# Altium schematic sheet blackfin_b_flash.SchDoc
size A3
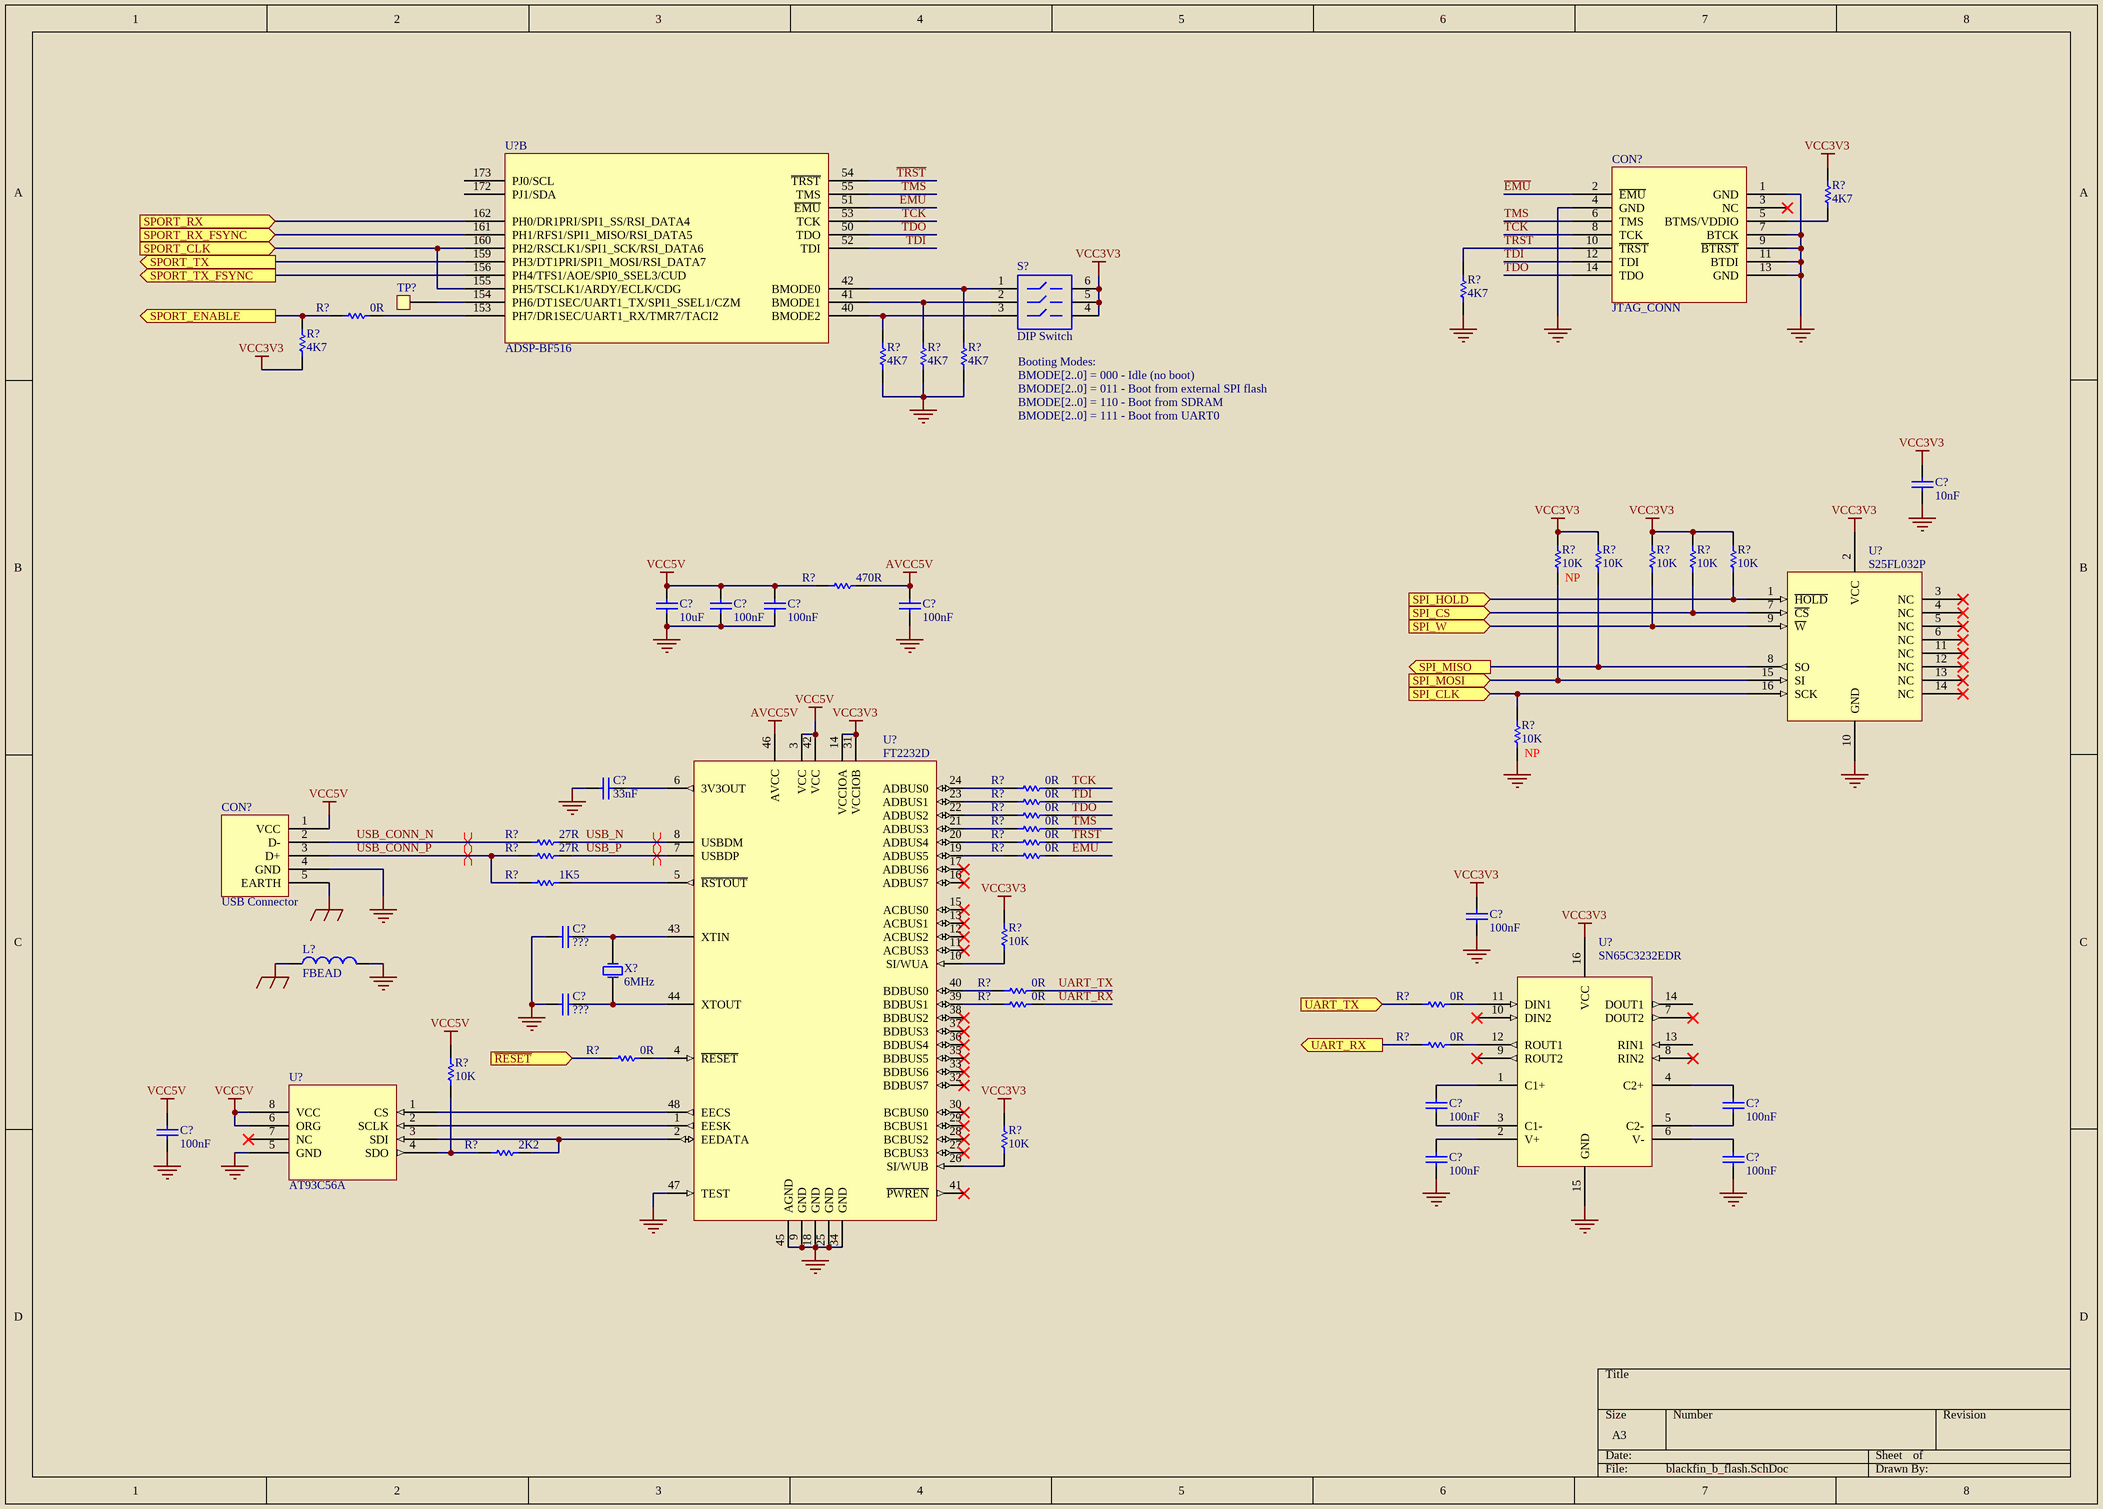
[diagram p0: blackfin_b_flash.SchDoc]

## Parts
(Parts that share a designator on the sheet are numbered #1, #2 ... from top to bottom, then left to right.)
C?#1  10nF  [C_0603]
C?#2  10uF  [C_0805]
C?#3  100nF  [C_0603]
C?#4  100nF  [C_0603]
C?#5  100nF  [C_0603]
C?#6  33nF  [C_0603]
C?#7  ???  [C_0603]
C?#8  100nF  [C_0603]
C?#9  ???  [C_0603]
C?#10  100nF  [C_0603]
C?#11  100nF  [C_0603]
C?#12  100nF  [C_0603]
C?#13  100nF  [C_0603]
C?#14  100nF  [C_0603]
CON?#1  JTAG_CONN  [HEADER_2x7]
CON?#2  USB Connector  [USB Connector]
L?  FBEAD  [L_0603]
R?#1  4K7  [R_0603]
R?#2  0R  [R_0603]
R?#3  4K7  [R_0603]
R?#4  4K7  [R_0603]
R?#5  4K7  [R_0603]
R?#6  4K7  [R_0603]
R?#7  4K7  [R_0603]
R?#8  470R  [R_0402]
R?#9  10K  [R_0603]
R?#10  10K  [R_0603]
R?#11  10K  [R_0603]
R?#12  10K  [R_0603]
R?#13  10K  [R_0603]
R?#14  10K  [R_0603]
R?#15  0R  [R_0603]
R?#16  0R  [R_0603]
R?#17  0R  [R_0603]
R?#18  0R  [R_0603]
R?#19  27R  [R_0603]
R?#20  0R  [R_0603]
R?#21  27R  [R_0603]
R?#22  0R  [R_0603]
R?#23  1K5  [R_0603]
R?#24  10K  [R_0603]
R?#25  0R  [R_0603]
R?#26  0R  [R_0603]
R?#27  0R  [R_0603]
R?#28  0R  [R_0603]
R?#29  0R  [R_0603]
R?#30  10K  [R_0603]
R?#31  10K  [R_0603]
R?#32  2K2  [R_0603]
S?  DIP Switch  [DIP Switch]
TP?  Test Point  [Test Point]  (value not drawn)
U?#1  ADSP-BF516  [LQFP-176]  (part B of 4)
U?#2  S25FL032P  [SO-16]
U?#3  FT2232D  [LQFP-48]
U?#4  SN65C3232EDR  [SOIC-16]
U?#5  AT93C56A  [SOIC-8]
X?  6MHz

## Ports
SPI_CLK (in), SPI_CS (in), SPI_HOLD (in), SPI_MISO (out), SPI_MOSI (in), SPI_W (in), SPORT_CLK (in), SPORT_ENABLE (out), SPORT_RX (in), SPORT_RX_FSYNC (in), SPORT_TX (out), SPORT_TX_FSYNC (out), UART_RX (out), UART_TX (in), ~{RESET} (in)

## Nets
AVCC5V: C?#5.2 R?#8.2 U?#3.46(AVCC)
EARTH: CON?#2.5(EARTH) L?.1
GND: C?#1.1 C?#2.1 C?#3.1 C?#4.1 C?#5.1 C?#6.2 C?#7.1 C?#8.1 C?#9.1 C?#12.1 C?#13.1 C?#14.1 CON?#1.1(GND) CON?#1.4(GND) CON?#1.7(BTCK) CON?#1.9(~{BTRST}) CON?#1.11(BTDI) CON?#1.13(GND) CON?#2.4(GND) L?.2 R?#3.1 R?#5.1 R?#6.1 R?#7.1 R?#14.1 U?#2.10(GND) U?#3.9(GND) U?#3.18(GND) U?#3.25(GND) U?#3.34(GND) U?#3.45(AGND) U?#3.47(TEST) U?#4.15(GND) U?#5.5(GND)
VCC3V3: C?#1.2 C?#8.2 R?#1.2 R?#4.1 R?#9.2 R?#10.2 R?#11.2 R?#12.2 R?#13.2 R?#24.1 R?#31.1 S?.4 S?.5 S?.6 U?#2.2(VCC) U?#3.14(VCCIOA) U?#3.31(VCCIOB) U?#4.16(VCC)
VCC5V: C?#2.2 C?#3.2 C?#4.2 C?#12.2 CON?#2.1(VCC) R?#8.1 R?#30.2 U?#3.3(VCC) U?#3.42(VCC) U?#5.6(ORG) U?#5.8(VCC)
~{EMU}: CON?#1.2(~{EMU}) R?#22.2 U?#1.51(~{EMU})
~{RESET}: R?#29.1 ; port ~{RESET}
SPI_CLK: R?#14.2 U?#2.16(SCK) ; port SPI_CLK
SPI_CS: R?#12.1 U?#2.7(~{CS}) ; port SPI_CS
SPI_HOLD: R?#13.1 U?#2.1(~{HOLD}) ; port SPI_HOLD
SPI_MISO: R?#10.1 U?#2.8(SO) ; port SPI_MISO
SPI_MOSI: R?#9.1 U?#2.15(SI) ; port SPI_MOSI
SPI_W: R?#11.1 U?#2.9(~{W}) ; port SPI_W
SPORT_CLK: U?#1.155(PH5/TSCLK1/ARDY/ECLK/CDG) U?#1.160(PH2/RSCLK1/SPI1_SCK/RSI_DATA6) ; port SPORT_CLK
SPORT_ENABLE: R?#2.1 R?#4.2 ; port SPORT_ENABLE
SPORT_RX: U?#1.162(PH0/DR1PRI/SPI1_SS/RSI_DATA4) ; port SPORT_RX
SPORT_RX_FSYNC: U?#1.161(PH1/RFS1/SPI1_MISO/RSI_DATA5) ; port SPORT_RX_FSYNC
SPORT_TX: U?#1.159(PH3/DT1PRI/SPI1_MOSI/RSI_DATA7) ; port SPORT_TX
SPORT_TX_FSYNC: U?#1.156(PH4/TFS1/AOE/SPI0_SSEL3/CUD) ; port SPORT_TX_FSYNC
~{TRST}: CON?#1.10(~{TRST}) R?#3.2 R?#20.2 U?#1.54(~{TRST})
TCK: CON?#1.8(TCK) R?#15.2 U?#1.53(TCK)
TDI: CON?#1.12(TDI) R?#16.2 U?#1.52(TDI)
TDO: CON?#1.14(TDO) R?#17.2 U?#1.50(TDO)
TMS: CON?#1.6(TMS) R?#18.2 U?#1.55(TMS)
UART_RX: R?#26.2
UART_RX: R?#28.1 ; port UART_RX  [a separate net that carries the same name]
UART_TX: R?#25.2
UART_TX: R?#27.1 ; port UART_TX  [a separate net that carries the same name]
USB_CONN_N: CON?#2.2(D-) R?#19.1
USB_CONN_P: CON?#2.3(D+) R?#21.1 R?#23.1
USB_N: R?#19.2 U?#3.8(USBDM)
USB_P: R?#21.2 U?#3.7(USBDP)
NetC?#6_1: C?#6.1 U?#3.6(3V3OUT)
NetC?#7_2: C?#7.2 U?#3.43(XTIN) X?.2(OSC2)
NetC?#9_2: C?#9.2 U?#3.44(XTOUT) X?.1(OSC1)
NetC?#10_1: C?#10.1 U?#4.3(C1-)
NetC?#10_2: C?#10.2 U?#4.1(C1+)
NetC?#11_1: C?#11.1 U?#4.5(C2-)
NetC?#11_2: C?#11.2 U?#4.4(C2+)
NetC?#13_2: C?#13.2 U?#4.2(V+)
NetC?#14_2: C?#14.2 U?#4.6(V-)
NetCON?#1_5: CON?#1.5(BTMS/VDDIO) R?#1.1
NetR?#2_2: R?#2.2 U?#1.153(PH7/DR1SEC/UART1_RX/TMR7/TACI2)
NetR?#5_2: R?#5.2 S?.3 U?#1.40(BMODE2)
NetR?#6_2: R?#6.2 S?.2 U?#1.41(BMODE1)
NetR?#7_2: R?#7.2 S?.1 U?#1.42(BMODE0)
NetR?#15_1: R?#15.1 U?#3.24(ADBUS0)
NetR?#16_1: R?#16.1 U?#3.23(ADBUS1)
NetR?#17_1: R?#17.1 U?#3.22(ADBUS2)
NetR?#18_1: R?#18.1 U?#3.21(ADBUS3)
NetR?#20_1: R?#20.1 U?#3.20(ADBUS4)
NetR?#22_1: R?#22.1 U?#3.19(ADBUS5)
NetR?#23_2: R?#23.2 U?#3.5(~{RSTOUT})
NetR?#24_2: R?#24.2 U?#3.10(SI/WUA)
NetR?#25_1: R?#25.1 U?#3.40(BDBUS0)
NetR?#26_1: R?#26.1 U?#3.39(BDBUS1)
NetR?#27_2: R?#27.2 U?#4.11(DIN1)
NetR?#28_2: R?#28.2 U?#4.12(ROUT1)
NetR?#29_2: R?#29.2 U?#3.4(~{RESET})
NetR?#30_1: R?#30.1 R?#32.2 U?#5.4(SDO)
NetR?#31_2: R?#31.2 U?#3.26(SI/WUB)
NetR?#32_1: R?#32.1 U?#3.2(EEDATA) U?#5.3(SDI)
NetTP?_1: TP?.1 U?#1.154(PH6/DT1SEC/UART1_TX/SPI1_SSEL1/CZM)
NetU?#3_1: U?#3.1(EESK) U?#5.2(SCLK)
NetU?#3_48: U?#3.48(EECS) U?#5.1(CS)

Not connected (* = marked no-connect by the designer): CON?#1 3(NC)*; U?#1 172(PJ1/SDA) 173(PJ0/SCL); U?#2 3(NC)* 4(NC)* 5(NC)* 6(NC)* 11(NC)* 12(NC)* 13(NC)* 14(NC)*; U?#3 11(ACBUS3)* 12(ACBUS2)* 13(ACBUS1)* 15(ACBUS0)* 16(ADBUS7)* 17(ADBUS6)* 27(BCBUS3)* 28(BCBUS2)* 29(BCBUS1)* 30(BCBUS0)* 32(BDBUS7)* 33(BDBUS6)* 35(BDBUS5)* 36(BDBUS4)* 37(BDBUS3)* 38(BDBUS2)* 41(~{PWREN})*; U?#4 7(DOUT2)* 8(RIN2)* 9(ROUT2)* 10(DIN2)* 13(RIN1) 14(DOUT1); U?#5 7(NC)*

## Layout directives
differential pair: USB_CONN_N, USB_CONN_P, USB_N, USB_P

## Notes on the sheet
- Booting Modes:
- BMODE[2..0] = 000 - Idle (no boot)
- BMODE[2..0] = 011 - Boot from external SPI flash
- BMODE[2..0] = 110 - Boot from SDRAM
- BMODE[2..0] = 111 - Boot from UART0
- (near R?#9) NP
- (near R?#14) NP

## Library data of the parts
C?#1 = Capacitor: eVendorPart#: 77-VJ0603Y103KXAPBC; Manufacturer: Vishay/Vitramon; Part#: VJ0603Y103KXAPW1BC; eVendor: Mouser; eVendorPrice: 0,05; MSRP: 0,013; MOQ: 1000
C?#2 = Capacitor: eVendorPart#: 810-C2012Y5V1C106Z; Manufacturer: TDK; Part#: C2012Y5V1C106Z; eVendor: Mouser; eVendorPrice: 0,10; MSRP: 0,05; MOQ: 1000
C?#3-C?#5 C?#8 C?#10-C?#14 = Capacitor: eVendorPart#: 81-GRM188R71E104KA01; Manufacturer: Murata; Part#: GRM188R71E104KA01J; eVendor: Mouser; eVendorPrice: 0,14; MSRP: 0,11; MOQ: 1000
C?#6 = Capacitor: eVendorPart#: 81-GRM18B11E333KA01D; Manufacturer: Murata; Part#: GRM188B11E333KA01D; eVendor: Mouser; eVendorPrice: 0,07; MSRP: 0,013; MOQ: 1000
C?#7 C?#9 = Capacitor: eVendor: *; eVendorPart#: *; eVendorPrice: *; Manufacturer: *; Part#: *; MOQ: *; MSRP: *
CON?#1 = JTAG Connector: eVendorPart#: 538-15-91-0140; Manufacturer: Molex; eVendor: Mouser; eVendorPrice: 1,00; MSRP: 0,62; MOQ: 1000; Part#: 15-91-0140
CON?#2 = USB Connector: eVendorPart#: 649-61729-0010BLF; Manufacturer: FCI; Part#: 61729-0010BLF; eVendor: Mouser; eVendorPrice: 0,58; MSRP: 0,39; MOQ: 1000
L? = Inductor: eVendorPart#: 875-MI0603L301R-10; Manufacturer: Laird Technologies; Part#: MI0603L301R-10; eVendor: Mouser; eVendorPrice: 0,16; MSRP: 0,066; MOQ: 1000
R?#1 R?#3-R?#7 = Resistor: eVendorPart#: 71-CRCW0603J-4.7K-E3; Part#: CRCW06034K70JNEA; Manufacturer: Vishay/Dale; eVendor: Mouser; eVendorPrice: 0,06; MSRP: 0,01; MOQ: 1000
R?#2 R?#15-R?#18 R?#20 R?#22 R?#25-R?#29 = Resistor: eVendorPart#: 71-CRCW06030000Z0EB; Part#: CRCW06030000Z0EB; Manufacturer: Vishay/Dale; eVendor: Mouser; eVendorPrice: 0,06; MSRP: 0,015; MOQ: 1000
R?#8 = Resistor: eVendor: *; eVendorPart#: *; Part#: *; eVendorPrice: *; Manufacturer: *; MOQ: *; MSRP: *
R?#9-R?#14 R?#24 R?#30 R?#31 = Resistor: eVendorPart#: 71-CRCW0603-10K-E3; Part#: CRCW060310K0FKEA; Manufacturer: Vishay/Dale; eVendor: Mouser; eVendorPrice: 0,06; MSRP: 0,015; MOQ: 1000
R?#19 R?#21 = Resistor: eVendorPart#: 71-CRCW0603-27-E3; Part#: CRCW060327R0FKEA; Manufacturer: Vishay/Dale; eVendor: Mouser; eVendorPrice: 0,06; MSRP: 0,015; MOQ: 1000
R?#23 = Resistor: eVendorPart#: 71-CRCW0603-1.5K-E3; Part#: CRCW06031K50FKEA; Manufacturer: Vishay/Dale; eVendor: Mouser; eVendorPrice: 0,06; MSRP: 0,015; MOQ: 1000
R?#32 = Resistor: eVendorPart#: 71-CRCW06032K20JNEB; Part#: CRCW06032K20JNEB; Manufacturer: Vishay/Dale; eVendor: Mouser; eVendorPrice: 0,06; MSRP: 0,01; MOQ: 1000
S? = DIP Switch: eVendorPart#: 611-SDA03H1SBD; Manufacturer: C&K Components; Part#: SDA03H1SBD; eVendor: Mouser; eVendorPrice: 1,21; MSRP: 0,73; MOQ: 1000
TP? = Test Point: eVendor: NÃO SE APLICA; eVendorPrice: 0,00; eVendorPart#: NÃO SE APLICA; Part#: NÃO SE APLICA; Manufacturer: NÃO SE APLICA; MOQ: 1000; MSRP: 0,00
U?#1 = ADSP-BF516: Part#: ADSP-BF516BSWZ-3; Manufacturer: Analog Devices; eVendor: *; eVendorPart#: *; eVendorPrice: *; MOQ: *; MSRP: *
U?#2 = S25FL032P: Part#: S25FL032P0XMFI001; Manufacturer: Spansion; eVendor: Arrow; eVendorPrice: 2,10; eVendorPart#: S25FL032P0XMFI001; MOQ: 1000; MSRP: 2,10
U?#3 = FT2232D: eVendorPart#: 895-FT2232D; Manufacturer: FTDI; eVendor: Mouser; MSRP: 3,80; eVendorPrice: 6,99; Part#: FT2232D; MOQ: 1000
U?#4 = RS-232 Transceiver: eVendorPart#: 595-SN65C3232EDR; Manufacturer: Texas Instruments; eVendor: Mouser; MSRP: 0,932; eVendorPrice: 1,41; Part#: SN65C3232EDR; MOQ: 1000
U?#5 = AT93C56A: eVendorPart#: 556-A93C56A10SU2.7; Manufacturer: Atmel; Part#: AT93C56A-10SU-2.7; eVendor: Mouser; eVendorPrice: 0,42; MSRP: 0,24; MOQ: 1000
X? = XTAL: eVendor: *; eVendorPrice: *; eVendorPart#: *; Part#: *; MOQ: *; MSRP: *; Manufacturer: *